# EAGLE schematic Zio Qwiic 1.5in. OLED Display (EAGLE 9.2.2)
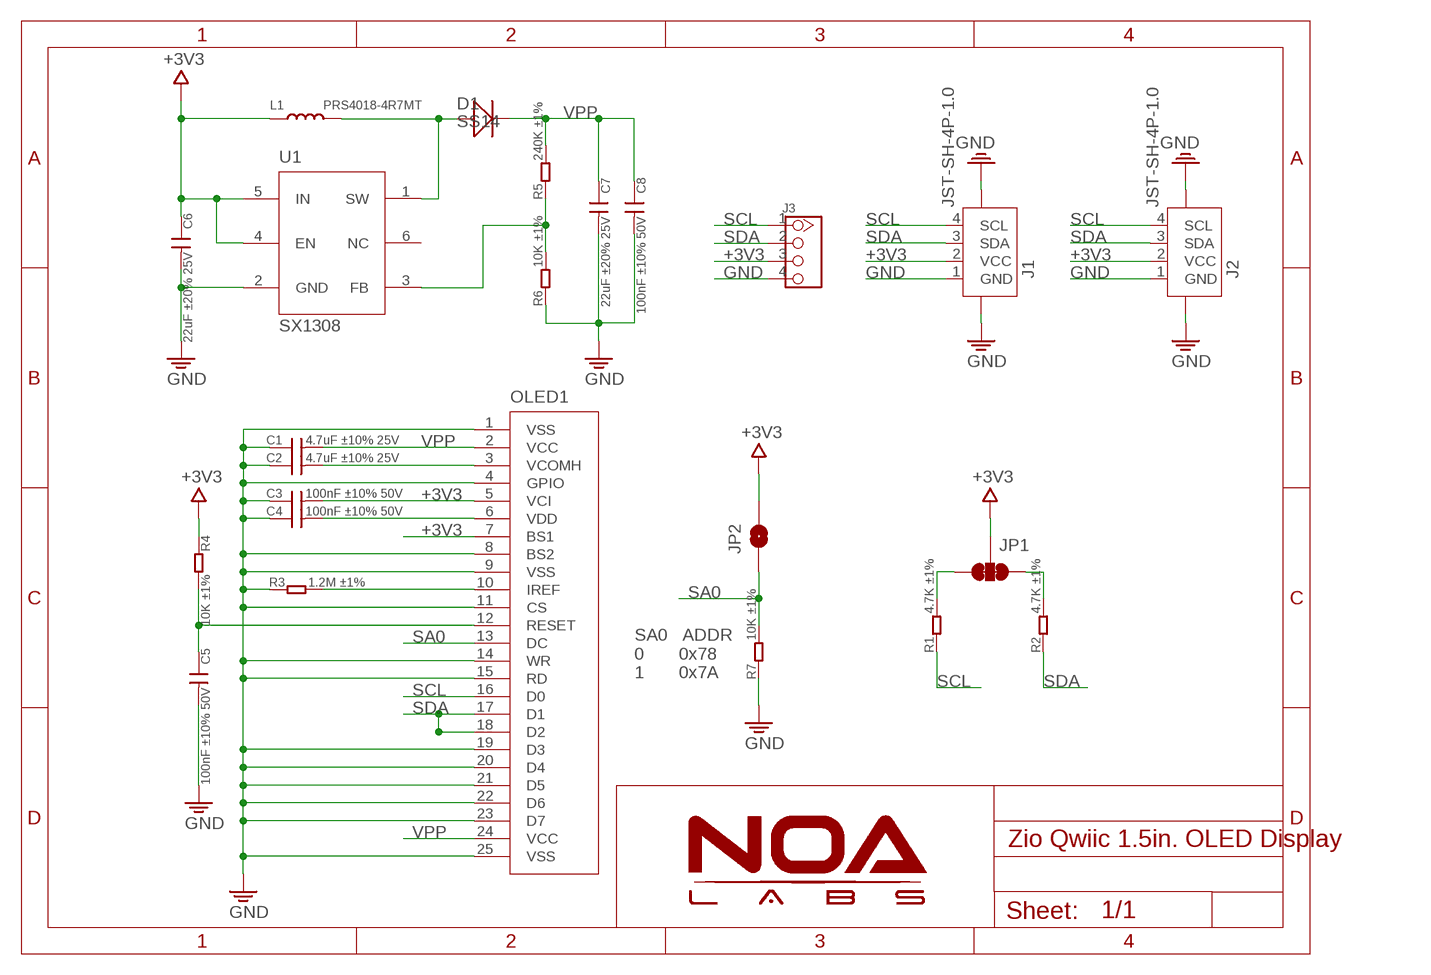
[diagram p0: schematic, sheet 1]

## Parts
C1  4.7uF ±10% 25V  C-0603  [C0603]
C2  4.7uF ±10% 25V  C-0603  [C0603]
C3  100nF ±10% 50V  C-0603  [C0603]
C4  100nF ±10% 50V  C-0603  [C0603]
C5  100nF ±10% 50V  C-0603  [C0603]
C6  22uF ±20% 25V  C-0805  [C0805]
C7  22uF ±20% 25V  C-0805  [C0805]
C8  100nF ±10% 50V  C-0603  [C0603]
D1  SS14  D214AA  [DO-214AC]
J1  JST-SH-4P-1.0  [JST-SH-4P]
J2  JST-SH-4P-1.0  [JST-SH-4P]
J3  HEADER-4P-60/35MIL  [4P-65/35MIL]
JP1  SMT-JUMPER_3_2-NC_TRACE  [SMT-JUMPER_3_2-NC_TRACE]
JP2  JUMPER-SMT_2_NC_PASTE_NOCREM  [SMT-JUMPER_2_NC_PASTE_SILK_NOCREM]
L1  PRS4018-4R7MT  L-4030  [L4030]
OLED1  OLED_MODULE_1.5IN_128128  [OLED_MODULE_1.5IN_128*128]
R1  4.7K ±1%  R-0603  [R0603]
R2  4.7K ±1%  R-0603  [R0603]
R3  1.2M ±1%  R-0603  [R0603]
R4  10K ±1%  R-0603  [R0603]
R5  240K ±1%  R-0603  [R0603]
R6  10K ±1%  R-0603  [R0603]
R7  10K ±1%  R-0603  [R0603]
U1  SX1308  [SOT23-6]

## Nets
+3V3: C3.2 C6.1 J1.2(VCC) J2.2(VCC) J3.3 JP1.2 JP2.2 L1.1 OLED1.5(VCI) OLED1.7(BS1) R4.1 U1.4(EN) U1.5(IN)
GND: C1.1 C2.1 C3.1 C4.1 C5.2 C6.2 C7.2 C8.2 J1.1(GND) J1.NC1 J1.NC2 J2.1(GND) J2.NC1 J2.NC2 J3.4 OLED1.1(VSS) OLED1.4(GPIO) OLED1.8(BS2) OLED1.9(VSS) OLED1.11(CS) OLED1.14(WR) OLED1.15(RD) OLED1.19(D3) OLED1.20(D4) OLED1.21(D5) OLED1.22(D6) OLED1.23(D7) OLED1.25(VSS) R3.1 R6.1 R7.1 U1.2(GND)
N$6: JP1.3 R1.2
N$7: R5.1 R6.2 U1.3(FB)
N$8: JP1.1 R2.2
N$16: C5.1 OLED1.12(RESET) R4.2
N$18: OLED1.10(IREF) R3.2
N$22: C4.2 OLED1.6(VDD)
N$25: C2.2 OLED1.3(VCOMH)
SA0: JP2.1 OLED1.13(DC) R7.2
SCL: J1.4(SCL) J2.4(SCL) J3.1 OLED1.16(D0) R1.1
SDA: J1.3(SDA) J2.3(SDA) J3.2 OLED1.17(D1) OLED1.18(D2) R2.1
SW: D1.A(+) L1.2 U1.1(SW)
VPP: C1.2 C7.1 C8.1 D1.C(-) OLED1.2(VCC) OLED1.24(VCC) R5.2
Unconnected: U1.6(NC)

## Notes on the sheet
- SA0   ADDR
  0       0x78
  1       0x7A

## Library data of the parts
C1-C8 = RCL:C
D1 = Discrete_NOA:D*
J1 J2 = Connector:JST-SH-4P
J3 = Connector_NOA:HEADER-4P
JP1 = NOA-Jumpers:SMT-JUMPER_3_2-NC_TRACE
JP2 = NOA-Jumpers:JUMPER-SMT_2_NC_PASTE_NOCREM
L1 = Discrete:L*
OLED1 = Discretex:OLED_MODULE_1.5IN_128*128
R1-R7 = RCL:R
U1 = IC:SX1308